# EAGLE design MAZE IR (EAGLE 9.6.2)
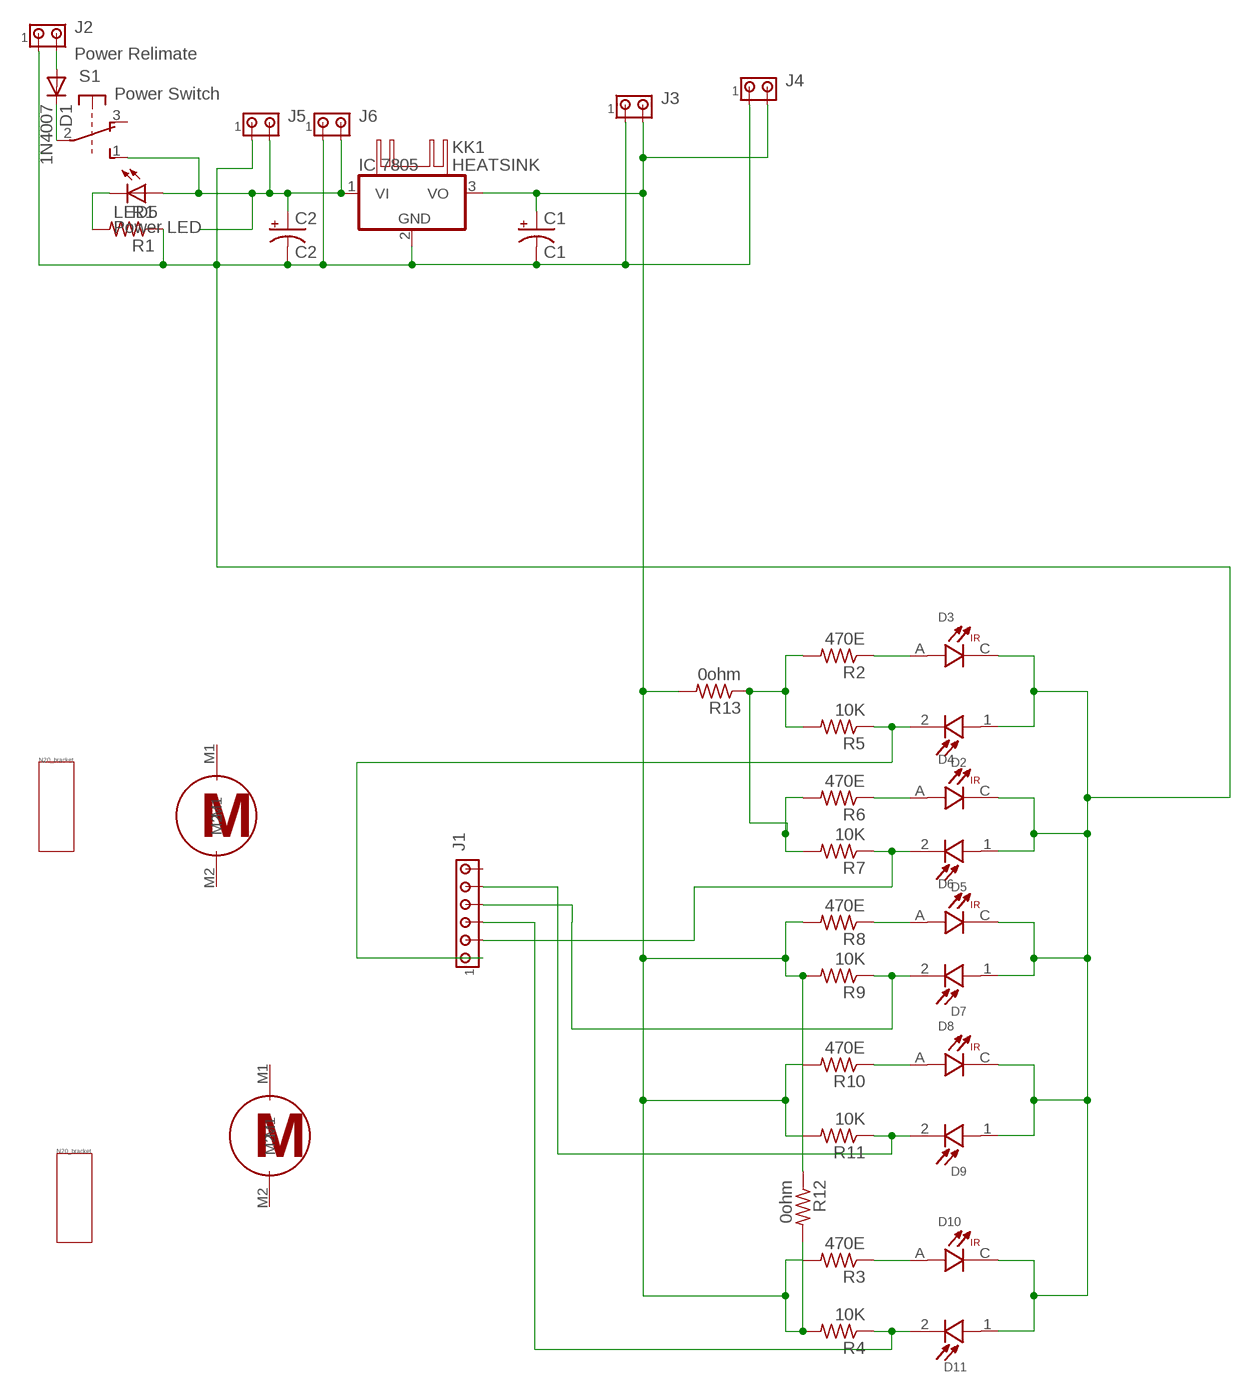
[diagram p0: schematic, sheet 1]

## Parts
C1  C1  1000UF-RADIAL-5MM-25V-20%  [CPOL-RADIAL-5MM-10MM]
C2  C2  CPOL-USE3.5-8  [E3,5-8]
D1  1N4007  1N4004  [DO41-10]
D2  SFH_213_FA  [XDCR_SFH_213_FA]
D3  TSHG8200  [LEDRD254W55D595H900]
D4  TSHG8200  [LEDRD254W55D595H900]
D5  SFH_213_FA  [XDCR_SFH_213_FA]
D6  TSHG8200  [LEDRD254W55D595H900]
D7  SFH_213_FA  [XDCR_SFH_213_FA]
D8  TSHG8200  [LEDRD254W55D595H900]
D9  SFH_213_FA  [XDCR_SFH_213_FA]
D10  TSHG8200  [LEDRD254W55D595H900]
D11  SFH_213_FA  [XDCR_SFH_213_FA]
IC3  IC 7805  7805TV  [TO220V]
J1  Line Tracer Relimate  MTA06-100  [10X06MTA]
J2  Power Relimate  MTA02-100  [10X02MTA]
J3  Power Relimate  MTA02-100  [10X02MTA]
J4  Power Relimate  MTA02-100  [10X02MTA]
J5  Power Relimate  MTA02-100  [10X02MTA]
J6  Power Relimate  MTA02-100  [10X02MTA]
KK1  HEATSINK  [HEATSINK]
LED5  Power LED  LED3MM  [LED3MM]
R1  R1  R-US_0204/7  [0204/7]
R2  470E  R-US_0204/7  [0204/7]
R3  470E  R-US_0204/7  [0204/7]
R4  10K  R-US_0204/7  [0204/7]
R5  10K  R-US_0204/7  [0204/7]
R6  470E  R-US_0204/7  [0204/7]
R7  10K  R-US_0204/7  [0204/7]
R8  470E  R-US_0204/7  [0204/7]
R9  10K  R-US_0204/7  [0204/7]
R10  470E  R-US_0204/7  [0204/7]
R11  10K  R-US_0204/7  [0204/7]
R12  0ohm  R-US_0204/7  [0204/7]
R13  0ohm  R-US_0204/7  [0204/7]
S1  Power Switch  9077-2  [9077-2]
U$1  MOTOR_N20  [MOTOR_N20]
U$2  MOTOR_N20  [MOTOR_N20]
U$4  N20_BRACKET  [BRACKER]
U$5  N20_BRACKET  [BRACKER]

## Nets
5V1: C1.+ IC3.3(VO) J3.2 J4.2 R3.2 R4.2 R8.2 R9.2 R10.2 R11.2 R12.1 R12.2 R13.2
12V: C2.+ IC3.1(VI) J5.2 J6.2 LED5.A S1.1(1:S)
GND1: C1.- C2.- D2.1(A) D3.C D4.C D5.1(A) D6.C D7.1(A) D8.C D9.1(A) D10.C D11.1(A) IC3.2(GND) J2.1 J3.1 J4.1 J5.1 J6.1 R1.1
N$1: D10.A R3.1
N$2: D1.A J2.2
N$4: D11.2(C) J1.4 R4.1
N$5: R2.2 R5.2 R6.2 R7.2 R13.1
N$6: LED5.K(C) R1.2
N$8: D3.A R2.1
N$11: D1.C S1.2(1:P)
N$12: D2.2(C) J1.6 R5.1
N$16: D9.2(C) J1.2 R11.1
N$19: D4.A R6.1
N$21: D5.2(C) J1.5 R7.1
N$45: D6.A D8.A R8.1 R10.1
N$46: D7.2(C) J1.3 R9.1
Unconnected: J1.1 S1.3(1:O) S1.4(2:S) S1.5(2:P) S1.6(2:O) U$1.M1 U$1.M2 U$2.M1 U$2.M2

## Library data of the parts
C1 = SparkFun-Capacitors:1000UF: 1,000µF/1mF ceramic capacitors A capacitor is a passive two-terminal electrical component used to store electrical energy temporarily in an electric field. CAP-08070; PROD_ID: CAP-09538; VALUE: 1mF
C2 = adafruit:CPOL-US: POLARIZED CAPACITOR, American symbol
D1 = adafruit:1N4004: DIODE General purpose 1N400x type rectifier (With bigger pads) http://www.ladyada.net/library/pcb/eaglelibrary.html
D2 D5 D7 D9 D11 = SFH_213_FA:SFH_213_FA: PIN IR photodiode; 5mm; 750-1100nm; 150mW; 10°; λp max: 900nm; 1mm Check availability <https://pricing.snapeda.com/parts/SFH%20213%20FA/OSRAM%20Opto/view-part?ref=eda>; AVAILABILITY: In Stock; CHECK_PRICES: https://www.snapeda.com/parts/SFH%20213%20FA/OSRAM+Opto+Semiconductors+Inc./view-part/?ref=eda; DESCRIPTION: Photodiode 900nm 5ns 20° Radial; MF: OSRAM Opto; MP: SFH 213 FA; PACKAGE: Radial Osram Opto; PRICE: None; PURCHASE-URL: https://www.snapeda.com/api/url_track_click_mouser/?unipart_id=232958&manufacturer=OSRAM Opto&part_name=SFH 213 FA&search_term=ir photodiode; SNAPEDA_LINK: https://www.snapeda.com/parts/SFH%20213%20FA/OSRAM+Opto+Semiconductors+Inc./view-part/?ref=snap
D3 D4 D6 D8 D10 = TSHG8200:TSHG8200: 830 nm 100 mA ±10° Through Hole High Speed Infrared Emitting Diode - T-1 3/4 Check availability <https://pricing.snapeda.com/parts/TSHG8200/Vishay%20Semiconductor/view-part?ref=eda>; AVAILABILITY: In Stock; CHECK_PRICES: https://www.snapeda.com/parts/TSHG8200/Vishay+Semiconductor+Opto+Division/view-part/?ref=eda; DESCRIPTION: Infrared (IR) Emitter 830nm 1.5V 100mA 120mW/sr @ 100mA 20° Radial, 5mm Dia (T 1 3/4); MF: Vishay Semiconductor; MP: TSHG8200; PACKAGE: Radial Vishay Semiconductor; PRICE: None; PURCHASE-URL: https://www.snapeda.com/api/url_track_click_mouser/?unipart_id=285393&manufacturer=Vishay Semiconductor&part_name=TSHG8200&search_term=ir led; SNAPEDA_LINK: https://www.snapeda.com/parts/TSHG8200/Vishay+Semiconductor+Opto+Division/view-part/?ref=snap
IC3 = linear@1:78*: Positive VOLTAGE REGULATOR Source: http://cache.national.com/ds/LM/LM78L05.pdf http://www.fairchildsemi.com/ds/LM/LM7805.pdf
J1 = con-amp:MTA06-100: AMP connector
J2-J6 = con-amp:MTA02-100: AMP connector
KK1 = heatsink:HEATSINK: Made by Aniruddha Damle (TRSKNCOE)
LED5 = adafruit:LED: LED OSRAM: - CHIPLED LG R971, LG N971, LY N971, LG Q971, LY Q971, LO R971, LY R971 LH N974, LH R974 LS Q976, LO Q976, LY Q976 LO Q996 - Hyper CHIPLED LW Q18S LB Q993, LB Q99A, LB R99A - SideLED LS A670, LO A670, LY A670, LG A670, LP A670 LB A673, LV A673, LT A673, LW A673 LH A674 LY A675 LS A676, LA A676, LO A676, LY A676, LW A676 LS A679, LY A679, LG A679 - Hyper Micro SIDELED® LS Y876, LA Y876, LO Y876, LY Y876 LT Y87S - SmartLED LW L88C, LW L88S LB L89C, LB L89S, LG L890 LS L89K, LO L89K, LY L89K LS L896, LA L896, LO L896, LY L896 - TOPLED LS T670, LO T670, LY T670, LG T670, LP T670 LSG T670, LSP T670, LSY T670, LOP T670, LYG T670 LG T671, LOG T671, LSG T671 LB T673, LV T673, LT T673, LW T673 LH T674 LS T676, LA T676, LO T676, LY T676, LB T676, LH T676, LSB T676, LW T676 LB T67C, LV T67C, LT T67C, LS T67K, LO T67K, LY T67K, LW E67C LS E67B, LA E67B, LO E67B, LY E67B, LB E67C, LV E67C, LT E67C LW T67C LS T679, LY T679, LG T679 LS T770, LO T770, LY T770, LG T770, LP T770 LB T773, LV T773, LT T773, LW T773 LH T774 LS E675, LA E675, LY E675, LS T675 LS T776, LA T776, LO T776, LY T776, LB T776 LHGB T686 LT T68C, LB T68C - Hyper Mini TOPLED® LB M676 - Mini TOPLED Santana® LG M470 LS M47K, LO M47K, LY M47K Source: http://www.osram.convergy.de/
R1-R13 = adafruit:R-US_: RESISTOR, American symbol
S1 = switch-misc:9077-2: MARQUARDT SWITCH 9077.0200 Distributor: Buerklin <https://www.buerklin.com/default.asp?event=ShowArtikel%2812G2822%29&l=d&jump=ArtNr_12G2822>
U$1 U$2 = Motor N20:MOTOR_N20
U$4 U$5 = Motor N20:N20_BRACKET

## Board
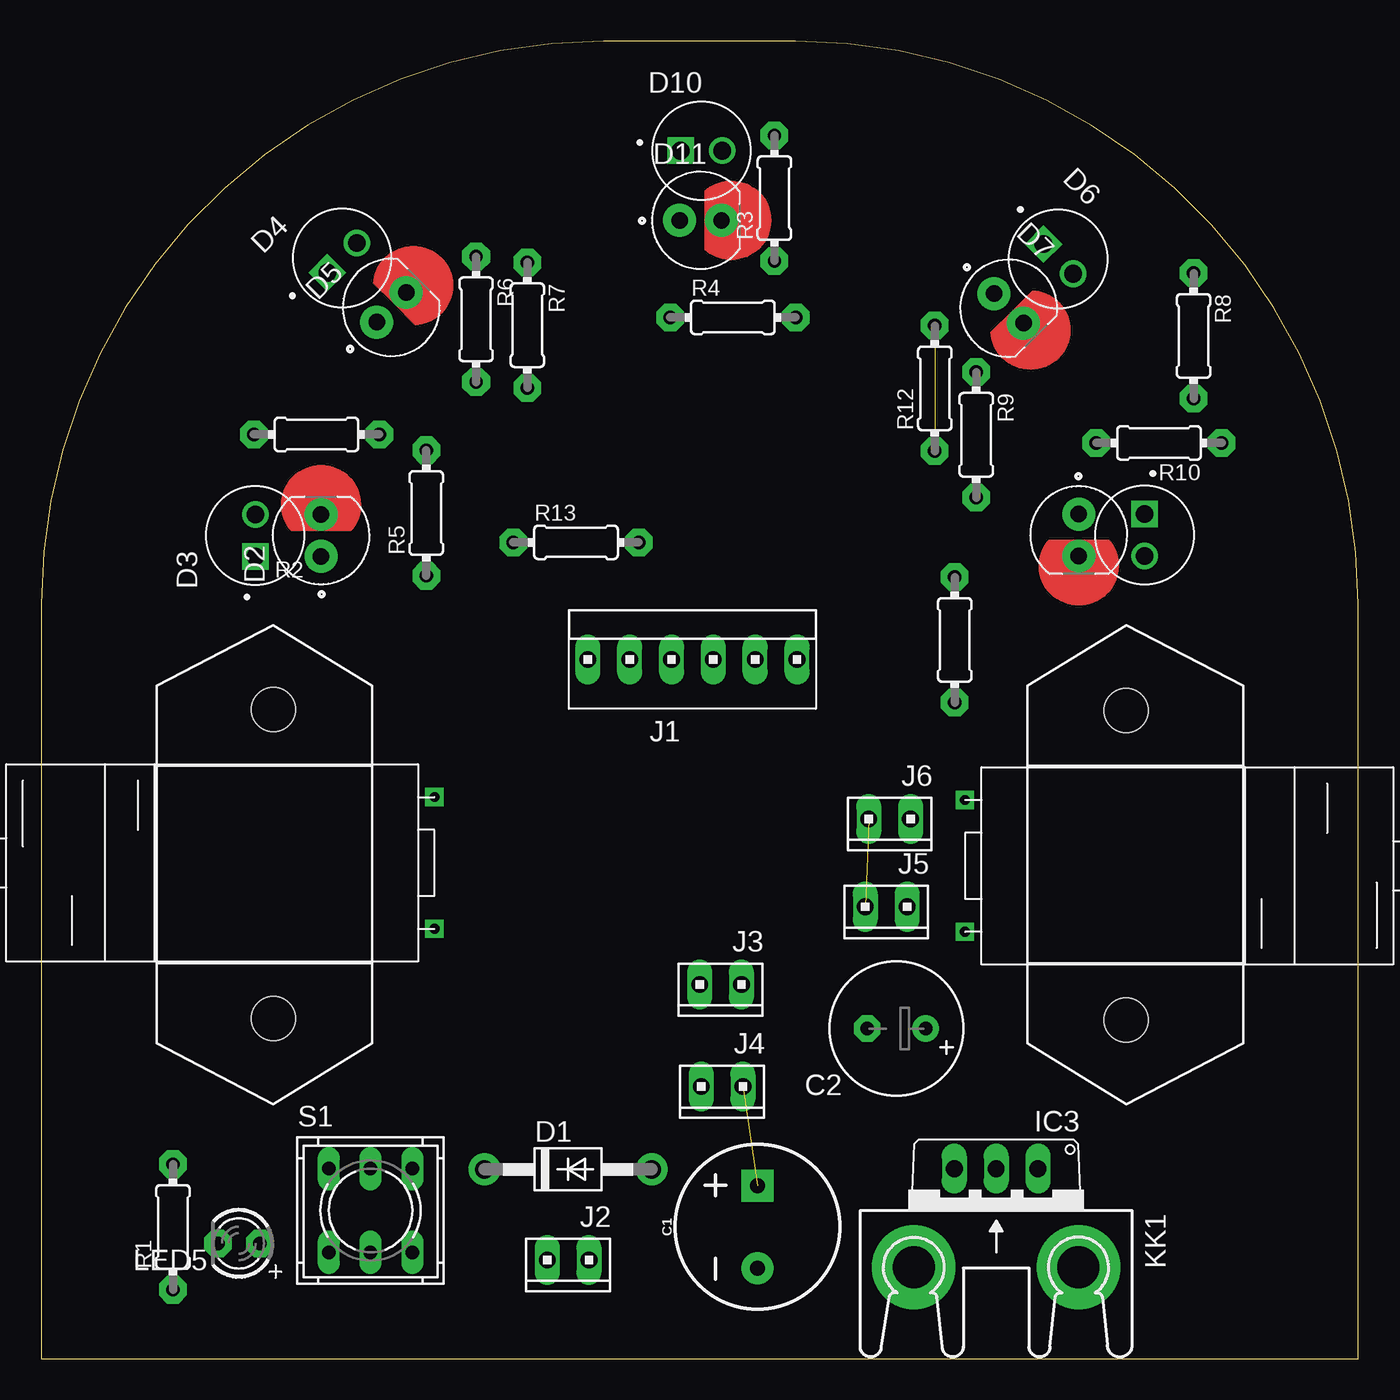
[diagram p1: board, top side]
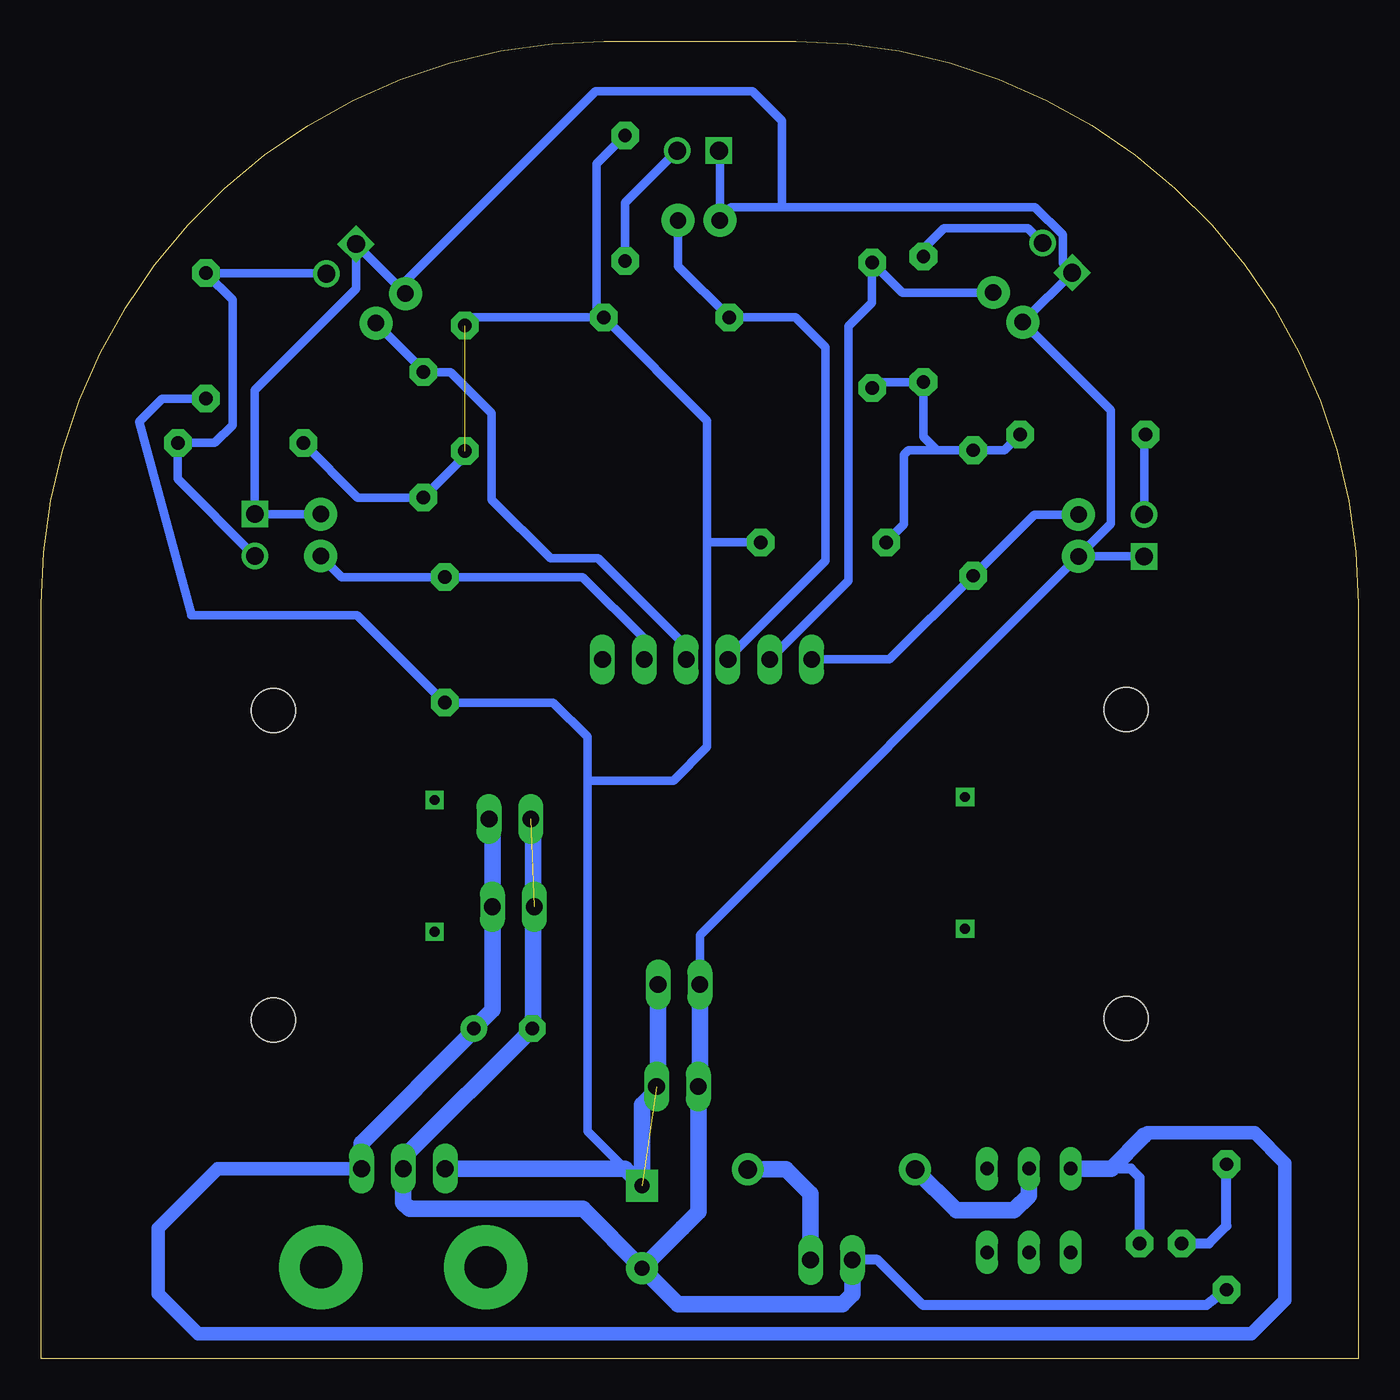
[diagram p2: board, bottom side, seen from below]

Size 80.01 x 80 mm. Coordinates in mm from the lower left corner, seen from the top.
Outline: 0.01,0 80.01,0 80.01,45.81 arc90 45.82,80 34.16,80 arc90 0,45.83 0.01,0
Copper layers (1*16): Top 0.035mm / dielectric 1.5mm / Bottom 0.035mm
Design rules "default *": minimum track width 10mil, minimum drill 24mil, track to track 8mil, track to pad 6mil, pad to pad 8mil, via to via 8mil, smd to smd 8mil, copper to edge 40mil, drill to drill 8mil, minimum pad ring 10mil, minimum via ring 8mil, stop-mask expansion 4mil, vias tented up to drill 0mil, thermal gap 10mil

### Footprints (pad centres in the part's own frame; a part is rotated, then mirrored left to right if it is on the bottom)
CPOL-RADIAL-5MM-10MM = drill 0.9 pad 1.93 square: + 2.5,0 | drill 0.9 pad 1.93: - -2.5,0
E3,5-8 = drill 0.813 pad 1.6: + -1.778,0 | drill 0.813 pad 1.6 octagon: - 1.778,0
DO41-10 = drill 1.118 pad 1.93: A 5.08,0; C -5.08,0
XDCR_SFH_213_FA = drill 1 pad 2: 1 -1.27,0; 2 1.27,0
LEDRD254W55D595H900 = drill 1.07 pad 1.61: A 1.27,0 | drill 1.07 pad 1.61 square: C -1.27,0
TO220V = drill 1.016 long: 1 -2.54,-2.54; 2 0,-2.54; 3 2.54,-2.54
10X06MTA = drill 1.016 long: 1 6.35,0; 2 3.81,0; 3 1.27,0; 4 -1.27,0; 5 -3.81,0; 6 -6.35,0
10X02MTA = drill 1.016 long: 1 1.27,0; 2 -1.27,0
HEATSINK = drill 2.54 pad 5.08: A2,5 -5,3.45; B2,5 5,3.45
LED3MM = drill 0.813 pad 1.676 octagon: A -1.27,0; K 1.27,0
0204/7 = drill 0.813 pad 1.676 octagon: 1 -3.81,0; 2 3.81,0
9077-2 = drill 0.813 long: 1 -2.54,2.54; 2 0,2.54; 3 2.54,2.54; 4 -2.54,-2.54; 5 0,-2.54; 6 2.54,-2.54
MOTOR_N20 = drill 0.6 square: M1 2,-1; M2 10,-1
BRACKER = hole 2.66: -3.43,7.1; 15.35,7.1

### Placement (x,y rotation side)
C1  43.51,8 90 top
C2  51.95,20.05 180 top
D1  32.01,11.5 0 top
D2  17,49.99 90 top
D3  13,49.99 90 top
D4  18.28,66.84 45 top
D5  21.28,63.84 45 top
D6  61.78,66.78 315 top
D7  58.78,63.78 315 top
D8  67.03,50.01 270 top
D9  63.03,50.01 270 top
D10  40.11,73.35 0 top
D11  40.05,69.12 0 top
IC3  58.01,9 180 top
J1  39.56,42.46 0 top
J2  32.01,6 180 top
J3  41.27,22.72 180 top
J4  41.36,16.52 180 top
J5  51.33,27.44 180 top
J6  51.54,32.78 180 top
KK1  58.01,9 180 top
LED5  12.01,7 180 top
R1  8.01,8 90 top
R2  16.72,56.12 0 top
R3  44.54,70.47 90 top
R4  42.02,63.23 0 top
R5  23.39,51.35 90 top
R6  26.42,63.11 270 top
R7  29.53,62.75 270 top
R8  70,62.11 270 top
R9  56.8,56.1 270 top
R10  67.9,55.6 180 top
R11  55.49,43.65 270 top
R12  54.28,58.92 90 top
R13  32.49,49.57 0 top
S1  20.01,9 0 top
U$1  57.12,35.92 270 top
U$2  22.89,24.11 90 top
U$4  7.01,36 270 top
U$5  73.01,24 90 top

### Tracks (layer width: path | path; a pad name or v marks a point on that pad's centre or on a via)
5V1  (2 unrouted)
  Bottom 0.508: 46.83,35.1 46.83,37.76 48.91,39.84 R11.2 60.8,45.15 70.87,45.15 | 46.83,35.1 46.83,13.83 C1.+ | R3.2 46.27,72.54 46.27,63.67 R4.2 | 70.9,45.15 70.87,45.15 | R10.2 60.77,52.29 R9.2 54.28,54.81 R12.1 | R4.2 39.55,56.95 39.55,49.64 | 39.55,49.64 39.55,37.16 41.61,35.1 46.83,35.1 | R13.2 39.49,49.57 39.55,49.64 | R8.2 72.67,58.3 74.04,56.88 70.87,45.15 | R4.2 53.78,63.23 R12.2
  Bottom 1.016: IC3.3 44.55,11.54 C1.+ 43.51,15.43 42.54,16.4 J3.2
12V
  Bottom 0.61: 69.29,11.54 69.27,11.54 | LED5.A 13.28,11 13.82,11.54 15.01,11.54
  Bottom 0.813: 69.27,11.54 IC3.1 | 69.29,11.54 72.9,7.93 72.9,3.94 70.48,1.52 6.5,1.52 4.47,3.56 4.47,11.88 6.3,13.72 12.83,13.72 13.02,13.53
  Bottom 1.016: 13.02,13.53 15.01,11.54 S1.1 | IC3.1 60.55,13.09 53.85,19.79 53.85,19.93 C2.+ 52.6,21.18 J5.2 52.6,32.57 J6.2
GND1  (1 unrouted)
  Bottom 0.508: 30.23,5.78 30.74,5.28 | D3.C D2.1 | D2.1 15.04,50.69 15.04,57.6 20.27,62.84 | 20.27,62.84 D5.1 | 20.27,62.84 20.27,63.05 D4.C 17.96,66.53 17.96,68.24 19.64,69.92 35.01,69.92 | 35.01,69.92 38.1,69.92 38.78,69.23 | 38.78,69.23 D11.1 | D10.C 38.78,73.29 38.78,69.23 | 35.01,69.92 35.01,75.18 36.79,76.97 46.34,76.97 57.88,65.43 D7.1 D6.C 60.88,64.96 67.03,58.81 D8.C D9.1 | D2.1 40,25.73 J3.1
  Bottom 0.61: R1.1 9.23,3.25 26.45,3.25 29.2,6 J2.1
  Bottom 1.016: J2.1 30.74,5.28 30.74,3.91 31.34,3.31 41.32,3.31 C1.- | C1.- 47.11,9.1 57.63,9.1 58.01,9.48 IC3.2 58.01,12.22 C2.- 50.13,20.09 50.13,32.65 J6.1 | 41.04,7.97 C1.- | C1.- 40.09,8.92 J4.1 40,16.62 J3.1
N$1
  Bottom 0.508: D10.A 44.54,70.19 R3.1
N$2
  Bottom 1.016: J2.2 33.28,10.02 34.76,11.5 D1.A
N$4
  Bottom 0.508: D11.2 41.32,66.35 R4.1 34.18,63.23 32.36,61.41 32.36,48.45 38.29,42.52 J1.4
N$5
  Bottom 0.508: R2.2 21.49,55.16 R5.2 25.59,55.16 | R13.1 27.59,50.66 27.59,54.88 27.31,55.16 25.59,55.16 | R7.2 29.18,59.3 R6.2 26.42,55.99 25.59,55.16
N$6
  Bottom 0.61: R1.2 8.01,8.07 9.08,7 LED5.K
N$8
  Bottom 0.508: R2.1 13,56.03 D3.A
N$11
  Bottom 1.016: S1.2 20.01,9.91 20.92,9 24.43,9 D1.C
N$12
  Bottom 0.508: D2.2 19.67,51.26 R5.1 28.48,42.46 J1.6
N$16
  Bottom 0.508: D9.2 61.74,47.46 R11.1 47.12,47.46 43.37,43.71 J1.2
N$19
  Bottom 0.508: D4.A 20.08,68.64 25.18,68.64 26.42,67.4 R6.1
N$21
  Bottom 0.508: D5.2 27.71,64.74 R7.1 29.53,64.12 30.96,62.69 30.96,47.24 J1.5
N$45
  Bottom 0.508: D8.A 71.71,53.42 R10.1 70.75,55.6 69.48,55.6 68.39,56.69 68.39,64.31 R8.1 62.71,65.92 D6.A
N$46
  Bottom 0.508: D7.2 56.8,60 R9.1 55.13,59.91 52.64,57.42 52.64,52.15 49.08,48.59 46.17,48.59 40.83,43.26 J1.3